# EAGLE design SMD Keyswitch Test (EAGLE 8.5.1)
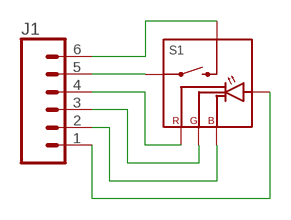
[diagram p0: schematic, sheet 1]

## Parts
J1  CONN_06FEMALE_LOCK  [1X06_FEMALE_LOCK.010]
S1  KEYSWITCH-RGBSMDLED-MX-1U-SMDRGB  [MX-1U-SMDRGB]

## Nets
N$1: J1.5 S1.MX1(P0)
N$2: J1.6 S1.MX2(P1)
N$3: J1.4 S1.R-
N$4: J1.3 S1.G-
N$5: J1.2 S1.B-
N$6: J1.1 S1.LED+

## Library data of the parts
J1 = SparkFun-Connectors:CONN_06: Multi connection point. Often used as Generic Header-pin footprint for 0.1 inch spaced/style header connections On any of the 0.1 inch spaced packages, you can populate with these: Break Away Headers - Straight <https://www.sparkfun.com/products/116> (PRT-00116) Break Away Male Headers - Right Angle <https://www.sparkfun.com/products/553> (PRT-00553) Female Headers <https://www.sparkfun.com/products/115> (PRT-00115) Break Away Headers - Machine Pin <https://www.sparkfun.com/products/117> (PRT-00117) Break Away Female Headers - Swiss Machine Pin <https://www.sparkfun.com/products/743> (PRT-00743) Arduino Stackable Header - 6 Pin <https://www.sparkfun.com/products/9280> (PRT-09280) For SCREWTERMINALS and SPRING TERMINALS visit here: Screw Terimnals on SparkFun.com <https://www.sparkfun.com/search/results?term=Screw+Terminals> (5mm/3.5mm/2.54mm spacing) This device is also useful as a general connection point to wire up your design to another part of your project. Our various solder wires solder well into these plated through hole pads. Hook-Up Wire - Assortment (Stranded, 22 AWG) <https://www.sparkfun.com/products/11375> (PRT-11375) Hook-Up Wire - Assortment (Solid Core, 22 AWG) <https://www.sparkfun.com/products/11367> (PRT-11367) View the entire wire category on our website here <https://www.sparkfun.com/categories/141>
S1 = Keyboard:KEYSWITCH-RGBSMDLED

## Board
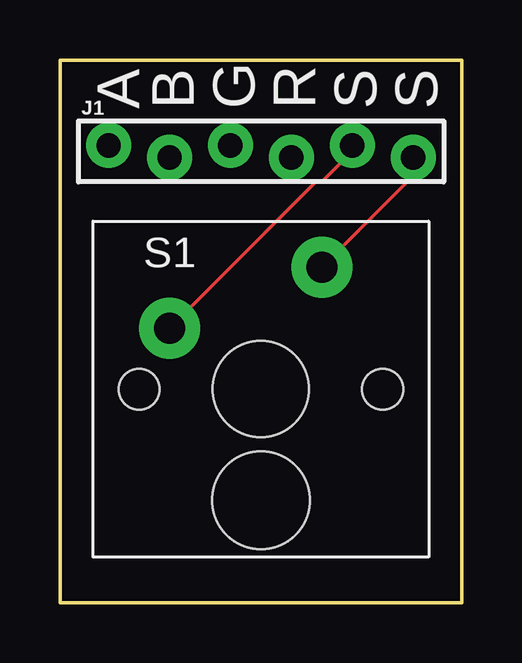
[diagram p1: board, top side]
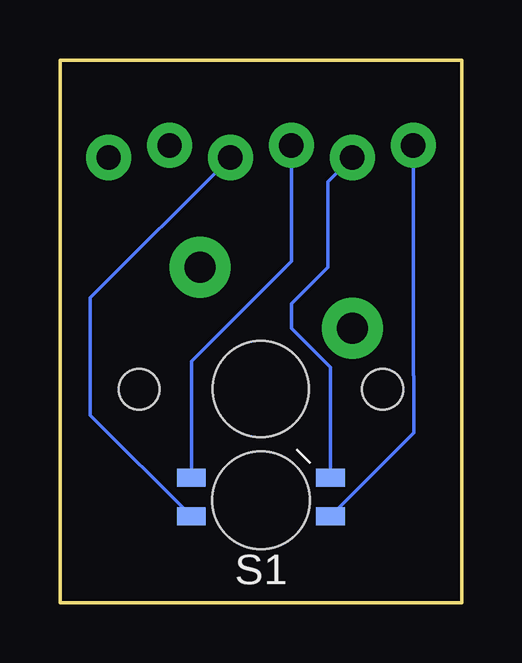
[diagram p2: board, bottom side, seen from below]

Size 16.76 x 22.61 mm. Coordinates in mm from the lower left corner, seen from the top.
Outline: 0,0 0,22.61 16.76,22.61 16.76,0 0,0
Copper layers (1*16): Top 0.0356mm / dielectric 1.5011mm / Bottom 0.0356mm
Design rules "oshpark-2layer": minimum track width 6mil, minimum drill 13mil, track to track 6mil, track to pad 6mil, pad to pad 6mil, via to via 6mil, smd to smd 6mil, copper to edge 15mil, drill to drill 6mil, minimum pad ring 7mil, minimum via ring 7mil, stop-mask expansion 2.5mil, vias tented up to drill 0mil, thermal gap 10mil

### Footprints (pad centres in the part's own frame; a part is rotated, then mirrored left to right if it is on the bottom)
1X06_FEMALE_LOCK.010 = drill 1.016 pad 1.88: 1 0,0.254; 2 2.54,-0.254; 3 5.08,0.254; 4 7.62,-0.254; 5 10.16,0.254; 6 12.7,-0.254
MX-1U-SMDRGB = smd 1.2 x 0.75 bottom: B- -2.9,-3.7; G- 2.9,-3.7; LED+ -2.9,-5.3; R- 2.9,-5.3 | drill 1.3 pad 2.54: MX1 -3.81,2.54; MX2 2.54,5.08 | hole 4: 0,0 | hole 1.7: -5.08,0; 5.08,0 | hole 4.064: 0,-4.627

### Placement (x,y rotation side)
J1  2.03,18.8 0 top
S1  8.38,8.89 0 top

### Tracks (layer width: path | path; a pad name or v marks a point on that pad's centre or on a via)
N$1
  Top 0.152: S1.MX1 10.67,17.53 10.92,17.53 12.19,18.8 J1.5
N$2
  Top 0.152: S1.MX2 14.73,17.78 J1.6
N$3
  Bottom 0.152: S1.R- 15.49,7.8 15.49,12.7 J1.4
N$4
  Bottom 0.152: S1.G- 11.28,10.05 7.11,14.22 J1.3
N$5
  Bottom 0.152: S1.B- 5.48,9.8 7.11,11.43 7.11,12.45 5.59,13.97 5.59,17.53 J1.2
N$6
  Bottom 0.152: J1.1 2.03,9.47 2,9.43 2,7.08 S1.LED+

### Text on the board
tPlace: A | B | G | R | S | S